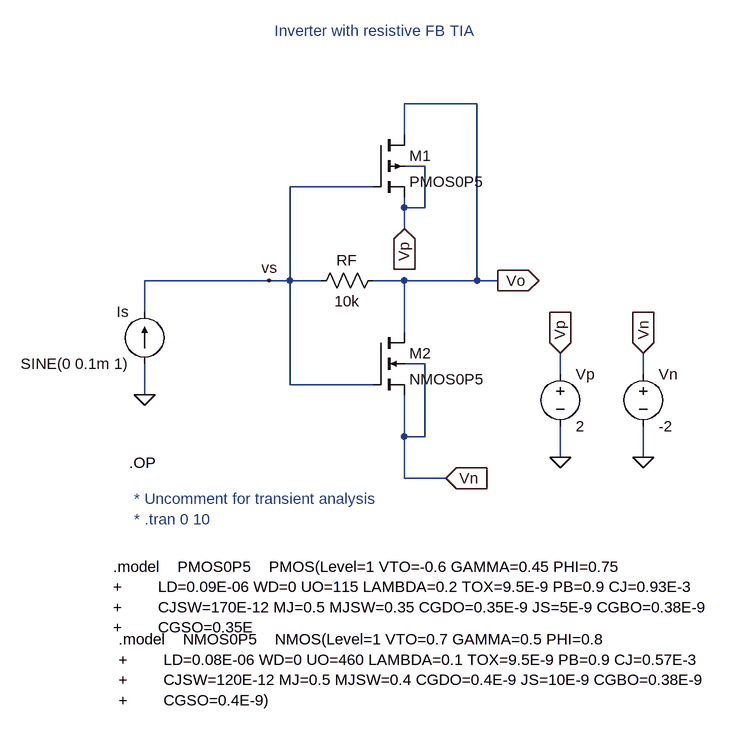
[diagram p0: schematic InverterFB_ltspice3_.asc]
InverterFB_ltspice3_.asc, the LTspice schematic file:
Version 4
SHEET 1 1044 680
WIRE 592 -256 480 -256
WIRE 480 -208 480 -256
WIRE 512 -160 480 -160
WIRE 432 -128 304 -128
WIRE 480 -96 480 -112
WIRE 512 -96 512 -160
WIRE 512 -96 480 -96
WIRE 480 -64 480 -96
WIRE 272 16 80 16
WIRE 304 16 304 -128
WIRE 304 16 272 16
WIRE 352 16 304 16
WIRE 480 16 432 16
WIRE 592 16 592 -256
WIRE 592 16 480 16
WIRE 624 16 592 16
WIRE 80 64 80 16
WIRE 480 96 480 16
WIRE 512 144 480 144
WIRE 720 160 720 128
WIRE 848 160 848 128
WIRE 304 176 304 16
WIRE 432 176 304 176
WIRE 80 192 80 144
WIRE 480 256 480 192
WIRE 512 256 512 144
WIRE 512 256 480 256
WIRE 720 288 720 240
WIRE 848 288 848 240
WIRE 480 320 480 256
WIRE 544 320 480 320
FLAG 480 -64 Vp
IOPIN 480 -64 In
FLAG 544 320 Vn
IOPIN 544 320 In
FLAG 80 192 0
FLAG 720 288 0
FLAG 848 288 0
FLAG 848 128 Vn
IOPIN 848 128 In
FLAG 720 128 Vp
IOPIN 720 128 In
FLAG 624 16 Vo
IOPIN 624 16 Out
FLAG 272 16 vs
SYMBOL res 448 0 R90
WINDOW 0 0 56 VBottom 2
WINDOW 3 32 56 VTop 2
SYMATTR InstName RF
SYMATTR Value 10k
SYMBOL voltage 720 144 R0
WINDOW 123 0 0 Left 0
WINDOW 39 0 0 Left 0
SYMATTR InstName Vp
SYMATTR Value 2
SYMBOL voltage 848 144 R0
WINDOW 123 0 0 Left 0
WINDOW 39 0 0 Left 0
SYMATTR InstName Vn
SYMATTR Value -2
SYMBOL nmos4 432 96 R0
SYMATTR InstName M2
SYMATTR Value NMOS0P5
SYMATTR Value2 l=3u w=20u
SYMBOL pmos4 432 -208 R0
SYMATTR InstName M1
SYMATTR Value PMOS0P5
SYMATTR Value2 l=3u w=60u
SYMBOL current 80 144 R180
WINDOW 0 24 80 Left 2
WINDOW 3 24 0 Left 2
SYMATTR InstName Is
SYMATTR Value SINE(0 0.1m 1)
TEXT 280 -368 Left 2 ;Inverter with resistive FB TIA
TEXT 32 456 Left 2 !.model	PMOS0P5	PMOS(Level=1 VTO=-0.6 GAMMA=0.45 PHI=0.75 \n+		LD=0.09E-06 WD=0 UO=115 LAMBDA=0.2 TOX=9.5E-9 PB=0.9 CJ=0.93E-3 \n+		CJSW=170E-12 MJ=0.5 MJSW=0.35 CGDO=0.35E-9 JS=5E-9 CGBO=0.38E-9\n+		CGSO=0.35E
TEXT 56 296 Left 2 !.OP
TEXT 40 568 Left 2 !.model	NMOS0P5	NMOS(Level=1 VTO=0.7 GAMMA=0.5 PHI=0.8 \n+		LD=0.08E-06 WD=0 UO=460 LAMBDA=0.1 TOX=9.5E-9 PB=0.9 CJ=0.57E-3 \n+		CJSW=120E-12 MJ=0.5 MJSW=0.4 CGDO=0.4E-9 JS=10E-9 CGBO=0.38E-9\n+		CGSO=0.4E-9)
TEXT 64 352 Left 2 ;* Uncomment for transient analysis\n* .tran 0 10

The netlist it stands for:
* InverterFB_ltspice3_.asc
RF Vo vs 10k
Vp Vp 0 2
Vn Vn 0 -2
M2 Vo vs Vn Vn NMOS0P5 l=3u w=20u
M1 Vo vs Vp Vp PMOS0P5 l=3u w=60u
Is 0 vs SINE(0 0.1m 1)
.model NMOS NMOS
.model PMOS PMOS
.lib standard.mos
* Inverter with resistive FB TIA
.model	PMOS0P5	PMOS(Level=1 VTO=-0.6 GAMMA=0.45 PHI=0.75
+		LD=0.09E-06 WD=0 UO=115 LAMBDA=0.2 TOX=9.5E-9 PB=0.9 CJ=0.93E-3
+		CJSW=170E-12 MJ=0.5 MJSW=0.35 CGDO=0.35E-9 JS=5E-9 CGBO=0.38E-9
+		CGSO=0.35E
.OP
.model	NMOS0P5	NMOS(Level=1 VTO=0.7 GAMMA=0.5 PHI=0.8
+		LD=0.08E-06 WD=0 UO=460 LAMBDA=0.1 TOX=9.5E-9 PB=0.9 CJ=0.57E-3
+		CJSW=120E-12 MJ=0.5 MJSW=0.4 CGDO=0.4E-9 JS=10E-9 CGBO=0.38E-9
+		CGSO=0.4E-9)
* * Uncomment for transient analysis
* * .tran 0 10
.backanno
.end